# EAGLE design B360C (EAGLE 6.6.0)
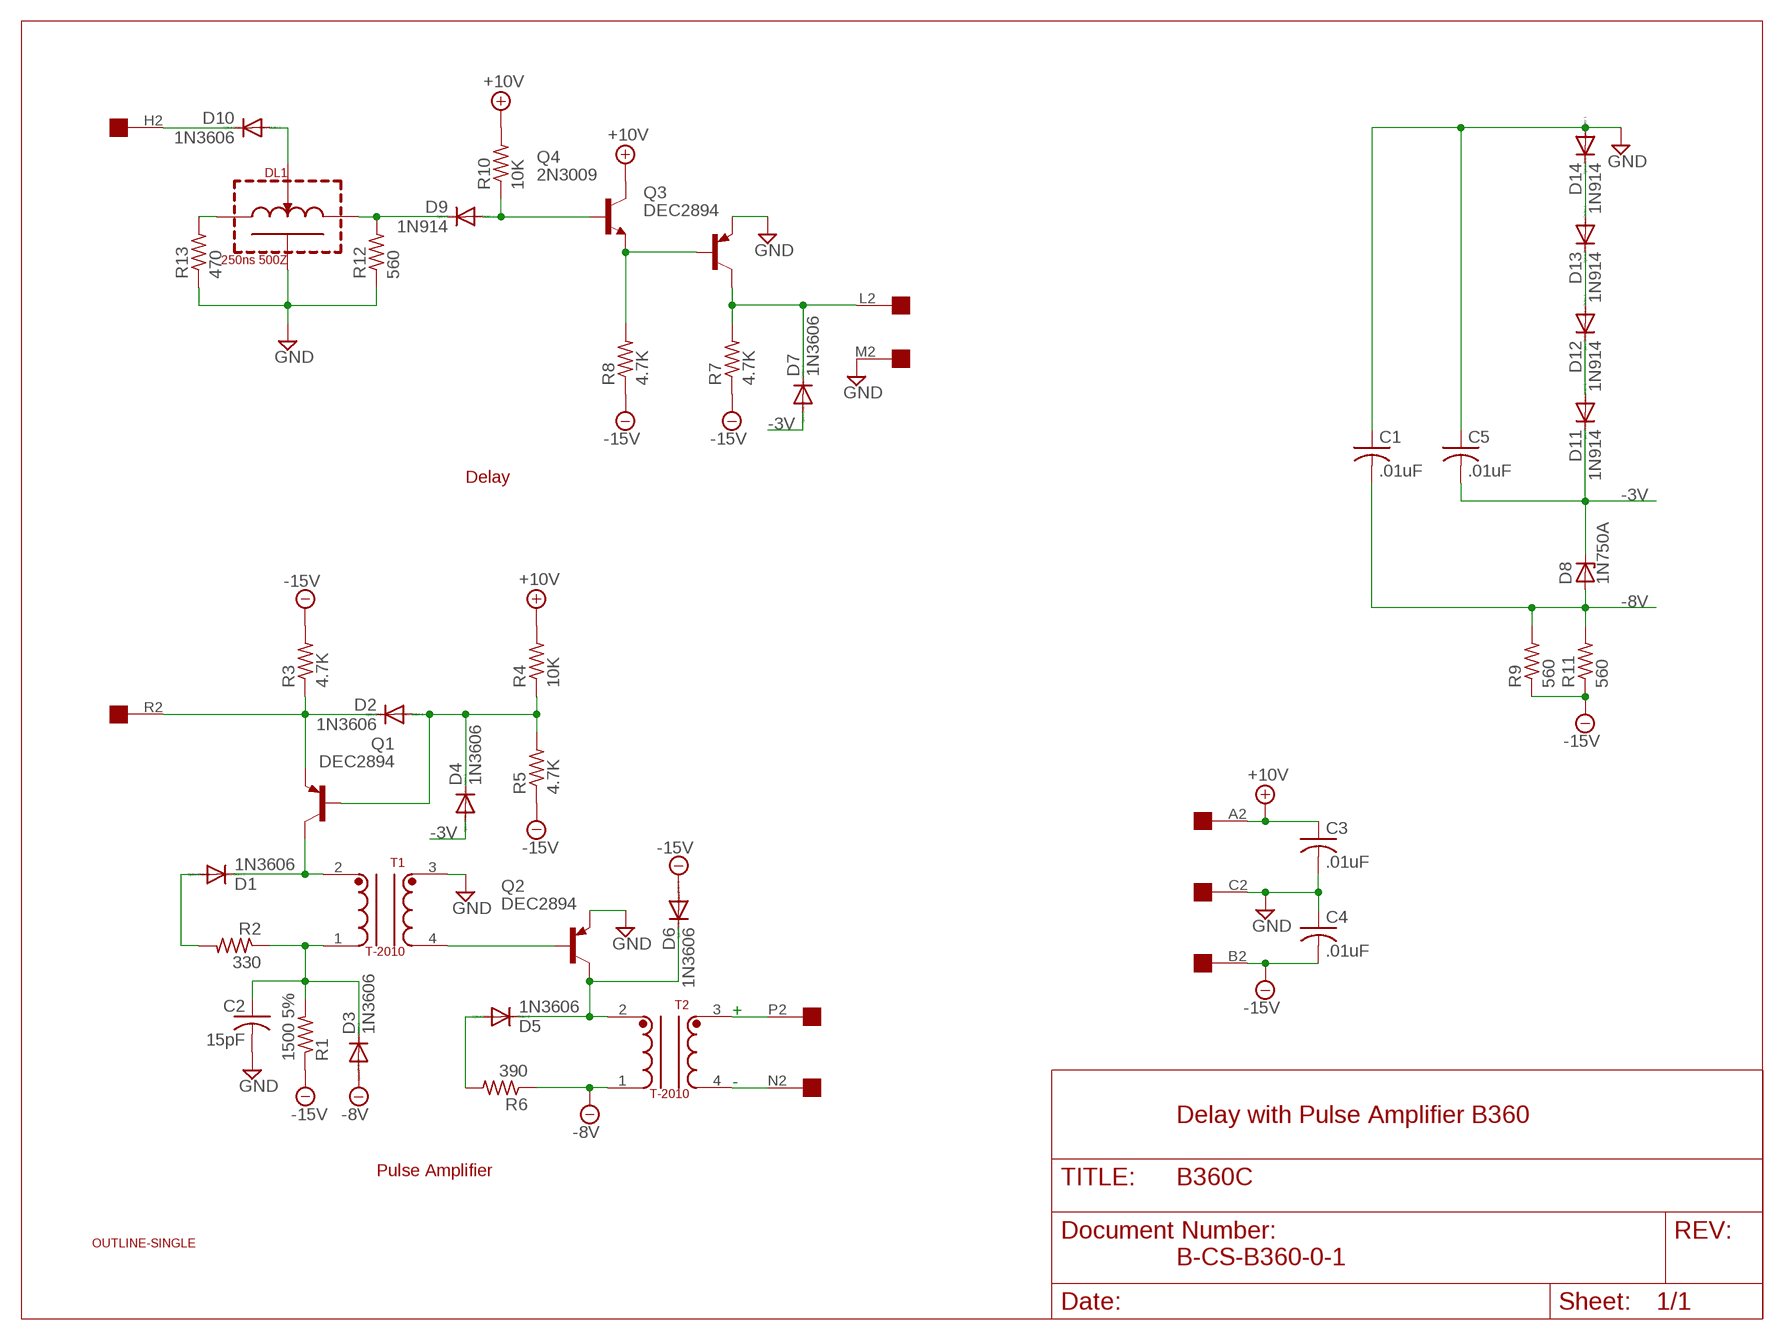
[diagram p0: schematic, sheet 1]

## Parts
C1  .01uF  C-US050-025X075  [C050-025X075]
C2  15pF  C-US050-025X075  [C050-025X075]
C3  .01uF  C-US050-025X075  [C050-025X075]
C4  .01uF  C-US050-025X075  [C050-025X075]
C5  .01uF  C-US050-025X075  [C050-025X075]
D1  1N3606  1N4148DO35-10  [DO35-10]
D2  1N3606  1N4148DO35-10  [DO35-10]
D3  1N3606  1N4148DO35-10  [DO35-10]
D4  1N3606  1N4148DO35-10  [DO35-10]
D5  1N3606  1N4148DO35-10  [DO35-10]
D6  1N3606  1N4148DO35-10  [DO35-10]
D7  1N3606  1N4148DO35-10  [DO35-10]
D8  1N750A  ZENER-DIODEDO35Z10  [DO35Z10]
D9  1N914  1N4148DO35-10  [DO35-10]
D10  1N3606  1N4148DO35-10  [DO35-10]
D11  1N914  1N4148DO35-10  [DO35-10]
D12  1N914  1N4148DO35-10  [DO35-10]
D13  1N914  1N4148DO35-10  [DO35-10]
D14  1N914  1N4148DO35-10  [DO35-10]
DL1  250ns 500Z  DELAYLINE  [DELAYLINE]
Q1  DEC2894  2N2904  [TO39]
Q2  DEC2894  2N2904  [TO39]
Q3  DEC2894  2N2904  [TO39]
Q4  2N3009  2N2102-NPN-TO39-EBC  [TO39]
R1  1500 5%  R-US_0207/10  [0207/10]
R2  330  R-US_0207/10  [0207/10]
R3  4.7K  R-US_0207/10  [0207/10]
R4  10K  R-US_0207/10  [0207/10]
R5  4.7K  R-US_0207/10  [0207/10]
R6  390  R-US_0207/10  [0207/10]
R7  4.7K  R-US_0207/10  [0207/10]
R8  4.7K  R-US_0207/10  [0207/10]
R9  560  R-US_0207/10  [0207/10]
R10  10K  R-US_0207/10  [0207/10]
R11  560  R-US_0207/10  [0207/10]
R12  560  R-US_0207/10  [0207/10]
R13  470  R-US_0207/10  [0207/10]
T1  T-2010  [TRANSFORMER2]
T2  T-2010  [TRANSFORMER2]
U$1  OUTLINE-SINGLE  [SINGLE]
U$2  EDGE-1  [EDGE-CON1]

## Nets
+10V [Supply]: C3.1 Q4.3(C) R4.2 R10.2 U$2.A2
-3V [Supply]: C5.2 D4.A D7.A D8.C D11.C
-8V: C1.2 D3.A D8.A R6.1 R9.2 R11.2 T2.1
-15V [Supply]: C4.2 D6.A R1.1 R3.2 R5.1 R7.1 R8.1 R9.1 R11.1 U$2.B2
GND [Supply]: C1.1 C2.2 C3.2 C4.1 C5.1 D14.A DL1.G Q2.1(E) Q3.1(E) R12.1 R13.1 T1.3 U$2.C2 U$2.M2
N$1: DL1.R R13.2
N$2: D10.A DL1.V
N$3: T2.3 U$2.P2
N$4: T2.4 U$2.N2
N$5: D10.C U$2.H2
N$6: D5.C D6.C Q2.3(C) T2.2
N$7: D9.C DL1.L R12.2
N$8: Q2.2(B) T1.4
N$9: D1.C Q1.3(C) T1.2
N$10: D5.A R6.2
N$11: Q3.2(B) Q4.1(E) R8.2
N$13: D1.A R2.2
N$14: C2.1 D3.C R1.2 R2.1 T1.1
N$15: D9.A Q4.2(B) R10.1
N$17: D2.C Q1.1(E) R3.1 U$2.R2
N$18: D7.C Q3.3(C) R7.2 U$2.L2
N$19: D2.A D4.C Q1.2(B) R4.1 R5.2
N$26: D13.A D14.C
N$27: D12.A D13.C
N$29: D11.A D12.C
Unconnected: U$2.D2 U$2.E2 U$2.F2 U$2.J2 U$2.K2 U$2.S2 U$2.T2 U$2.U2 U$2.V2

## Notes on the sheet
- Delay
- +
- -
- Delay with Pulse Amplifier B360
- Pulse Amplifier
- B-CS-B360-0-1

## Library data of the parts
C1-C5 = rcl:C-US: CAPACITOR, American symbol
D1-D7 D9-D14 = diode:1N4148: DIODE high speed (Philips)
D8 = diode:ZENER-DIODE: Z-Diode
DL1 = dec-con:DELAYLINE: Delay Line
Q1-Q3 = transistor-pnp:2N2904*: PNP Transistror
Q4 = transistor:*-NPN-: NPN Transistror BF959 corrected 2008.03.06
R1-R13 = rcl:R-US_: RESISTOR, American symbol
T1 T2 = dec-con:T-2010: Button Transformer
U$1 = dec-con:OUTLINE-*: Board outlines for DEC boards.
U$2 = dec-con:EDGE-1: Single-Sided DEC Edge Connector -- (side 2)

## Net classes
1 Supply: width 0.813 mm

## Board
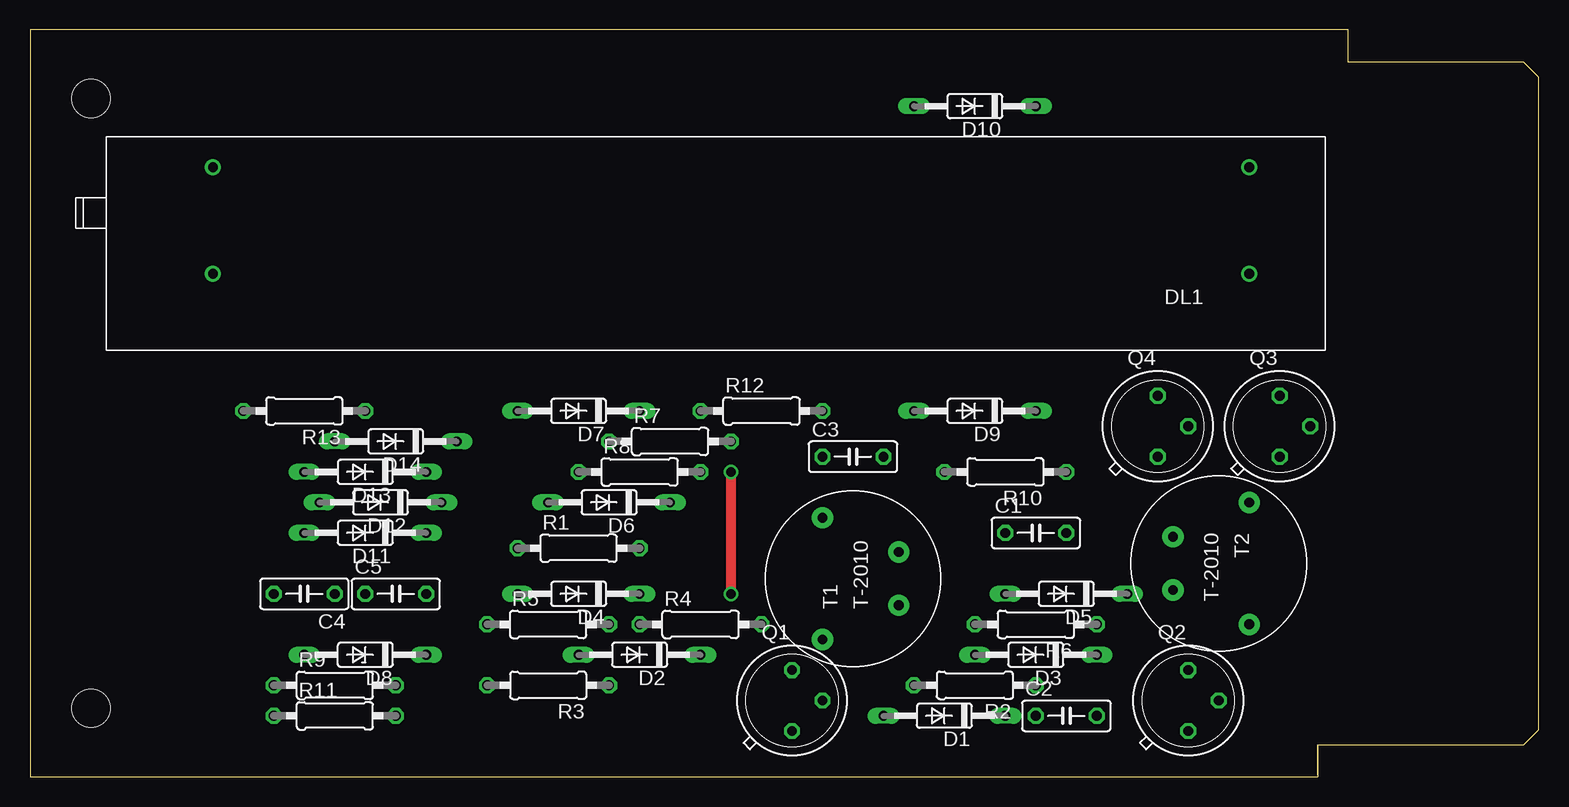
[diagram p1: board, top side]
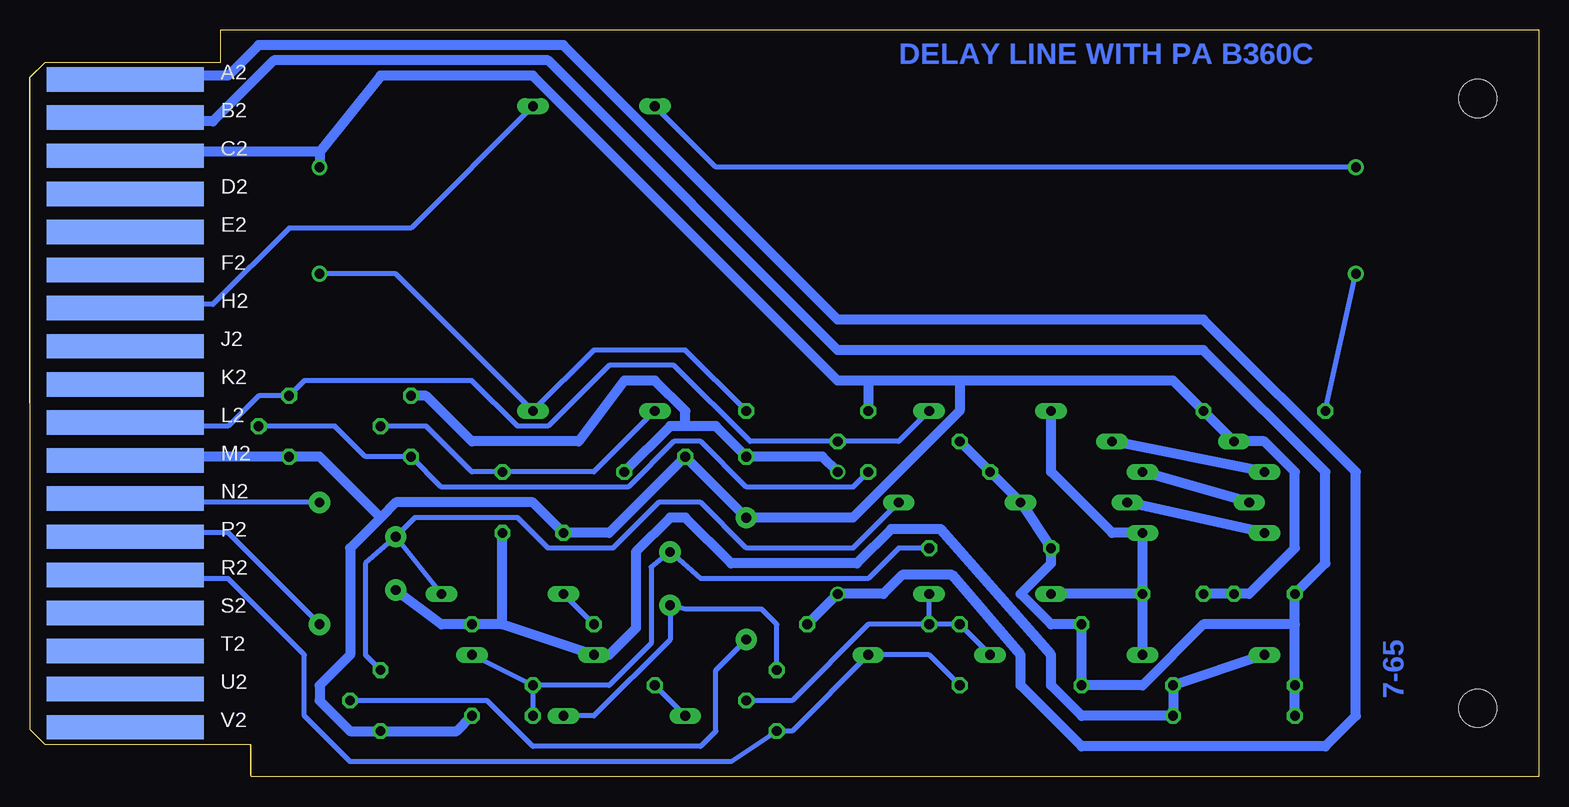
[diagram p2: board, bottom side, seen from below]

Size 125.73 x 62.23 mm. Coordinates in mm from the lower left corner, seen from the top.
Copper layers (1+16): Top 0.035mm / dielectric 1.5mm / Bottom 0.035mm
Design rules "16mils": minimum track width 16mil, minimum drill 32mil, track to track 15mil, track to pad 10mil, pad to pad 10mil, via to via 10mil, smd to smd 10mil, copper to edge 13mil, drill to drill 10mil, minimum pad ring 10mil, minimum via ring 8mil, stop-mask expansion 0mil, vias tented up to drill 0mil, thermal gap 10mil

### Footprints (pad centres in the part's own frame; a part is rotated, then mirrored left to right if it is on the bottom)
C050-025X075 = drill 0.813 octagon: 1 -2.54,0; 2 2.54,0
DO35-10 = drill 0.813 long: A 5.08,0; C -5.08,0
DO35Z10 = drill 0.813 long: A 5.08,0; C -5.08,0
DELAYLINE = drill 0.813: G -44.45,-7.62; L -44.45,1.27; R 41.91,1.27; V 41.91,-7.62
TO39 = drill 0.813 octagon: 1 0,-2.54; 2 2.54,0; 3 0,2.54
0207/10 = drill 0.813 octagon: 1 -5.08,0; 2 5.08,0
TRANSFORMER2 = drill 0.813 pad 1.778: 1 2.223,-3.81; 2 -2.223,-3.81; 3 5.08,2.54; 4 -5.08,2.54
SINGLE = hole 3.175: 120.65,56.515; 120.65,5.715
EDGE-CON1 = smd 13.106 x 2.032 bottom: A2 7.938,4.128; B2 7.938,7.303; C2 7.938,10.477; D2 7.938,13.652; E2 7.938,16.828; F2 7.938,20.003; H2 7.938,23.177; J2 7.938,26.352; K2 7.938,29.527; L2 7.938,32.703; M2 7.938,35.877; N2 7.938,39.053; P2 7.938,42.227; R2 7.938,45.403; S2 7.938,48.578; T2 7.938,51.752; U2 7.938,54.928; V2 7.938,58.102

### Placement (x,y rotation side)
C1  83.82,20.32 0 top
C2  86.36,5.08 0 top
C3  68.58,26.67 0 top
C4  22.86,15.24 180 top
C5  30.48,15.24 0 top
D1  76.2,5.08 180 top
D2  50.8,10.16 180 top
D3  83.82,10.16 180 top
D4  45.72,15.24 180 top
D5  86.36,15.24 180 top
D6  48.26,22.86 180 top
D7  45.72,30.48 180 top
D8  27.94,10.16 180 top
D9  78.74,30.48 180 top
D10  78.74,55.88 180 top
D11  27.94,20.32 180 top
D12  29.21,22.86 180 top
D13  27.94,25.4 180 top
D14  30.48,27.94 180 top
DL1  57.15,43.18 180 top
Q1  63.5,6.35 0 top
Q2  96.52,6.35 0 top
Q3  104.14,29.21 0 top
Q4  93.98,29.21 0 top
R1  45.72,19.05 0 top
R2  78.74,7.62 180 top
R3  43.18,7.62 180 top
R4  55.88,12.7 0 top
R5  43.18,12.7 0 top
R6  83.82,12.7 180 top
R7  53.34,27.94 0 top
R8  50.8,25.4 0 top
R9  25.4,7.62 0 top
R10  81.28,25.4 180 top
R11  25.4,5.08 0 top
R12  60.96,30.48 0 top
R13  22.86,30.48 180 top
T1  68.58,16.51 90 top
T2  99.06,17.78 270 top
U$1  125.73,62.23 180 top
U$2  125.73,62.23 180 top

### Tracks (layer width: path | path; a pad name or v marks a point on that pad's centre or on a via)
+10V  (via drill 0.81)
  Top 0.813: v58.42,15.24 v58.42,25.4
  Bottom 0.813: R4.2 v58.42,15.24 54.61,15.24 53.02,16.83 48.9,16.83 43.18,10.16 43.18,7.62 38.1,2.54 17.78,2.54 15.24,5.08 15.24,25.4 27.94,38.1 58.42,38.1 81.28,60.96 106.68,60.96 109.22,58.42 116.84,58.42 117.22,58.04 U$2.A2 | v58.42,25.4 59.69,26.67 C3.1 68.58,29.21 71.12,29.21 | 71.12,29.21 72.39,29.21 R10.2 | Q4.3 92.71,31.75 88.9,27.94 80.01,27.94 76.2,33.02 73.66,33.02 71.12,30.48 71.12,29.21
-3V
  Bottom 0.813: C5.2 D4.A | D8.C C5.2 | C5.2 D11.C 35.56,20.32 40.64,25.4 D7.A
-8V
  Bottom 0.813: D8.A R9.2 R11.2 38.1,5.08 40.64,7.62 40.64,10.16 49.85,20.64 53.98,20.64 56.83,17.78 67.31,17.78 71.12,21.59 72.39,21.59 75.25,18.73 75.25,12.38 77.47,10.16 D3.A 86.36,12.7 | T2.1 91.44,12.7 R6.1 86.36,12.7 | 86.36,12.7 C1.2
-15V
  Bottom 0.813: U$2.B2 117.13,54.9 116.84,54.61 110.49,54.61 105.41,59.69 82.55,59.69 58.42,35.56 27.94,35.56 17.78,25.4 17.78,17.78 C4.2 20.32,12.7 | R7.1 R8.1 D6.A R1.1 40.64,17.78 43.18,15.24 40.64,12.7 R5.1 R3.2 33.02,7.62 27.94,12.7 20.32,12.7 | R11.1 R9.1 20.32,12.7
GND
  Bottom 0.813: U$2.C2 117.17,51.74 116.84,52.07 101.6,52.07 | 101.6,52.07 DL1.G | 101.6,52.07 96.52,58.42 83.82,58.42 58.42,33.02 55.88,33.02 | C5.1 C4.1 24.13,15.24 20.32,19.05 20.32,25.4 22.86,27.94 D14.A R13.1 30.48,33.02 48.26,33.02 | 48.26,33.02 55.88,33.02 | 55.88,33.02 R12.1 | C2.2 90.17,3.81 Q2.1 99.06,3.81 101.6,6.35 101.6,7.62 99.06,10.16 99.06,19.05 96.52,21.59 | 96.52,21.59 95.25,22.86 83.82,22.86 C1.1 77.47,20.32 C3.2 T1.3 57.15,21.59 48.26,30.48 48.26,33.02 | U$2.M2 116.84,26.67 Q3.1 101.6,26.67 96.52,21.59
N$1
  Bottom 0.406: R13.2 DL1.R
N$2
  Bottom 0.406: DL1.V 68.58,50.8 D10.A
N$3
  Bottom 0.406: U$2.P2 116.84,20.32 109.22,20.32 T2.3
N$4
  Bottom 0.406: U$2.N2 116.84,22.86 T2.4
N$5
  Bottom 0.406: U$2.H2 117.17,39.04 116.84,39.37 110.49,39.37 104.14,45.72 93.98,45.72 D10.C
N$6
  Bottom 0.406: Q2.3 97.79,10.16 97.79,17.78 T2.2 | T2.2 D5.C | D6.C 57.15,19.05 66.04,19.05 69.85,22.86 73.34,22.86 77.15,19.05 82.55,19.05 85.09,21.59 93.66,21.59 T2.2
N$7
  Bottom 0.406: DL1.L 95.25,41.91 D9.C 78.74,35.56 71.12,35.56 R12.2
N$8
  Bottom 0.406: Q2.2 87.63,6.35 83.82,2.54 69.85,2.54 68.58,3.81 68.58,8.89 T1.4
N$9
  Bottom 0.406: Q1.3 63.5,12.7 64.77,13.97 71.12,13.97 T1.2 72.39,11.43 78.74,5.08 D1.C
N$10
  Bottom 0.406: R6.2 D5.A
N$11
  Bottom 0.406: Q3.2 100.33,29.21 97.79,26.67 Q4.1 91.44,24.13 75.88,24.13 72.07,27.94 69.85,27.94 66.04,24.13 57.15,24.13 R8.2
N$13
  Bottom 0.406: D1.A R2.2
N$14
  Bottom 0.406: R1.2 53.34,19.05 55.88,16.51 69.85,16.51 T1.1 73.98,17.46 73.98,11.11 77.47,7.62 R2.1 | R2.1 C2.1 | R2.1 D3.C
N$15
  Bottom 0.406: Q4.2 92.71,29.21 88.9,25.4 R10.1 78.74,25.4 D9.A
N$17
  Bottom 0.406: R3.1 50.8,10.16 D2.C 62.23,3.81 Q1.1 67.31,1.27 99.06,1.27 102.87,5.08 102.87,10.16 109.22,16.51 116.84,16.51 U$2.R2
N$18
  Bottom 0.406: U$2.L2 116.84,29.21 109.22,29.21 106.68,31.75 Q3.3 102.87,33.02 88.9,33.02 85.09,29.21 82.55,29.21 77.47,34.29 72.07,34.29 65.72,27.94 R7.2 53.34,27.94 D7.C
N$19
  Bottom 0.406: D2.A R5.2 R4.1 | R4.1 D4.C | R4.1 55.88,12.7 62.23,6.35 Q1.2
N$26
  Bottom 0.813: D13.A D14.C
N$27
  Bottom 0.813: D12.A D13.C
N$29
  Bottom 0.813: D11.A D12.C

### Text on the board
Bottom: DELAY LINE WITH PA B360C | 7-65